# EAGLE schematic ir_hid (EAGLE 6.5.0)
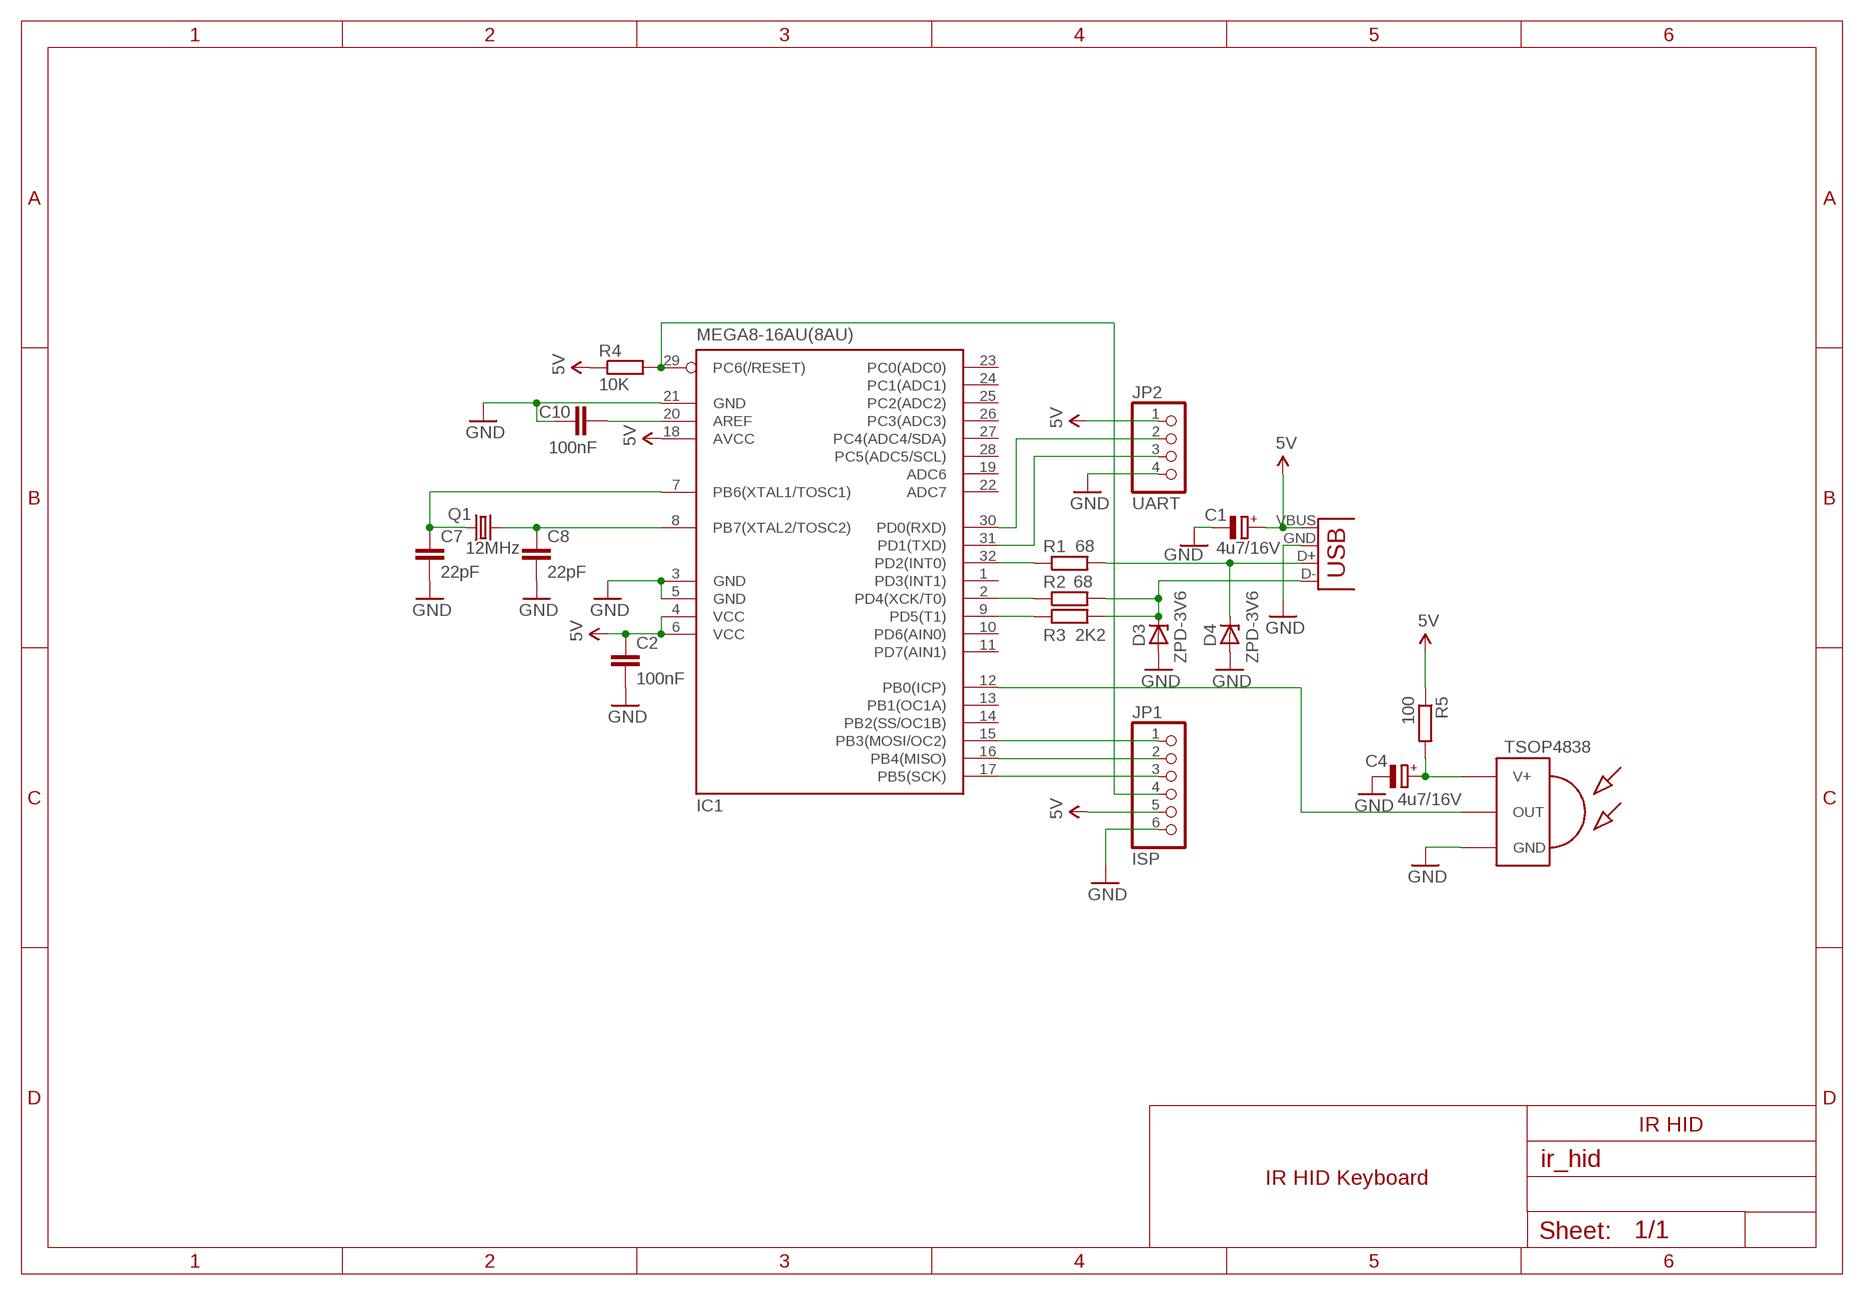
[diagram p0: schematic, sheet 1]

## Parts
C1  4u7/16V  CPOL-EUE2.5-5  [E2,5-5]
C2  100nF  C-EU025-024X044  [C025-024X044]
C4  4u7/16V  CPOL-EUE2.5-5  [E2,5-5]
C7  22pF  C-EU025-024X044  [C025-024X044]
C8  22pF  C-EU025-024X044  [C025-024X044]
C10  100nF  C-EU025-024X044  [C025-024X044]
D3  ZPD-3V6  ZPD  [DO35Z10]
D4  ZPD-3V6  ZPD  [DO35Z10]
IC1  MEGA8-16AU(8AU)  MEGA8-AI  [TQFP32-08]
JP1  ISP  PINHD-1X6  [1X06]
JP2  UART  PINHD-1X4  [1X04]
Q1  12MHz  CRYSTALHC49US  [HC49US]
R1  68  R-EU_0207/10  [0207/10]
R2  68  R-EU_0207/10  [0207/10]
R3  2K2  R-EU_0207/10  [0207/10]
R4  10K  R-EU_0207/10  [0207/10]
R5  100  R-EU_0207/10  [0207/10]
U$1  TSOP4838  [TSOP18XX]
X1  USBA-LP  USB-A-H  [USB-A-H]

## Nets
5V: C1.+ C2.1 IC1.4(VCC) IC1.6(VCC) IC1.18(AVCC) JP1.5 JP2.1 R4.1 R5.1 X1.VBUS(GND)
GND: C1.- C2.2 C4.- C7.2 C8.2 C10.1 D3.A D4.A IC1.3(GND) IC1.5(GND) IC1.21(GND) JP1.6 JP2.4 U$1.GND X1.GND(VBUS)
N$1: IC1.32(PD2(INT0)) R1.1
N$2: IC1.9(PD5(T1)) R3.1
N$3: IC1.2(PD4(XCK/T0)) R2.1
N$4: D4.C R1.2 X1.D+(D-)
N$5: C10.2 IC1.20(AREF)
N$6: D3.C R2.2 R3.2 X1.D-(D+)
N$7: C7.1 IC1.7(PB6(XTAL1/TOSC1)) Q1.1
N$8: C8.1 IC1.8(PB7(XTAL2/TOSC2)) Q1.2
N$9: IC1.29(PC6(/RESET)) JP1.4 R4.2
N$10: C4.+ R5.2 U$1.VCC(V+)
N$11: IC1.30(PD0(RXD)) JP2.2
N$12: IC1.15(PB3(MOSI/OC2)) JP1.1
N$13: IC1.16(PB4(MISO)) JP1.2
N$14: IC1.17(PB5(SCK)) JP1.3
N$15: IC1.31(PD1(TXD)) JP2.3
N$16: IC1.12(PB0(ICP)) U$1.OUT
Unconnected: IC1.1(PD3(INT1)) IC1.10(PD6(AIN0)) IC1.11(PD7(AIN1)) IC1.13(PB1(OC1A)) IC1.14(PB2(SS/OC1B)) IC1.19(ADC6) IC1.22(ADC7) IC1.23(PC0(ADC0)) IC1.24(PC1(ADC1)) IC1.25(PC2(ADC2)) IC1.26(PC3(ADC3)) IC1.27(PC4(ADC4/SDA)) IC1.28(PC5(ADC5/SCL))

## Notes on the sheet
- IR HID
- IR HID Keyboard

## Library data of the parts
C1 C4 = resistor:CPOL-EU: POLARIZED CAPACITOR, European symbol
C2 C7 C8 C10 = resistor:C-EU: CAPACITOR, European symbol
D3 D4 = diode:ZPD: Z DIODE 500 mW
IC1 = atmel:MEGA8: MICROCONTROLLER 8 Kbytes FLASH, 1 kbytes SRAM, 512 bytes EEPROM, USART, 6-channel 10 bit ADC, 2-channel 8 bit ADC Pin compatible with Atmega48, ATMega88, ATMega168 Source: avr.lbr; MPN: ATMEGA8-16AU; OC_FARNELL: 9171371; OC_NEWARK: 73M8863
JP1 = pinhead:PINHD-1X6: PIN HEADER
JP2 = pinhead:PINHD-1X4: PIN HEADER
Q1 = SparkFun:CRYSTAL: Crystals Various standard crystals. Proven footprints. Spark Fun Electronics SKU : COM-00534
R1-R5 = resistor:R-EU_: RESISTOR, European symbol
U$1 = tsop-1:TSOP4838: IR Receiver and Demodulator
X1 = SparkFun:USB: USB Connectors USB-B-PTH is fully proven SKU : PRT-00139 USB-miniB is fully proven SKU : PRT-00587 USB-A-PCB is untested. USB-A-H is throughly reviewed, but untested. Spark Fun Electronics SKU : PRT-00437 USB-B-SMT is throughly reviewed, but untested. Needs silkscreen touching up. USB-A-S has not been used/tested USB-MB-H has not been used/tested